# EAGLE design slide_pcb (EAGLE 9.3.0)
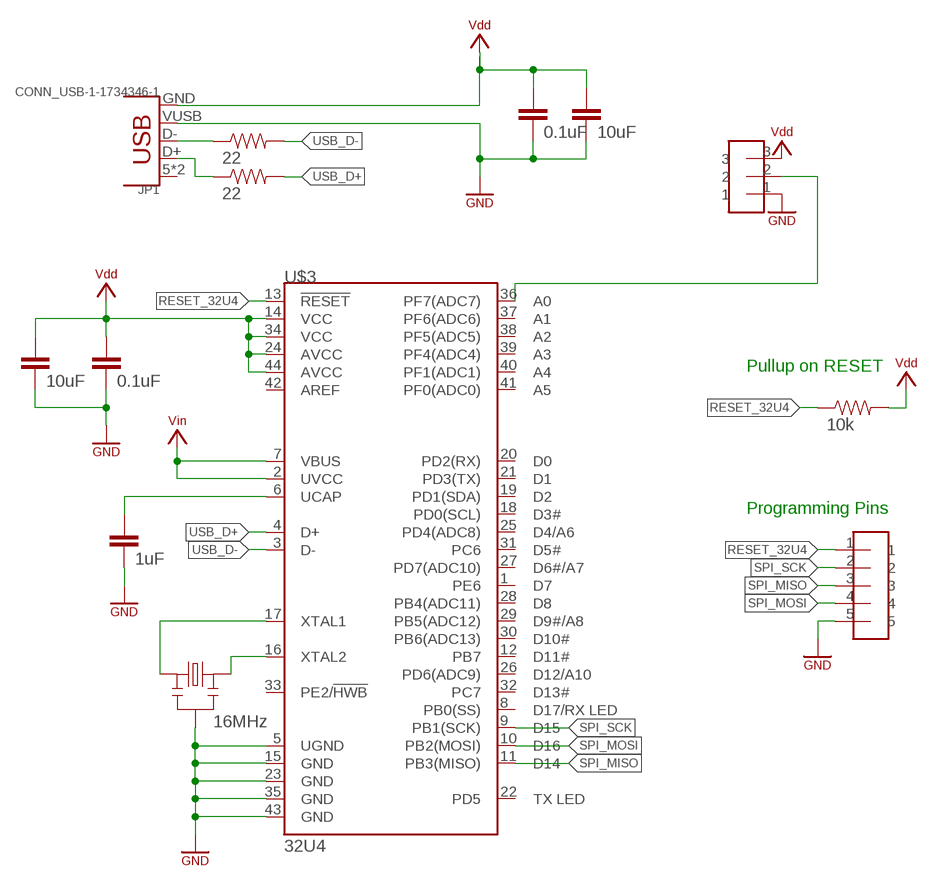
[diagram p0: schematic, sheet 1]

## Parts
C1  0.1uF  COMPONENT_CAP-0805  [0805]
C2  10uF  COMPONENT_CAP-0805  [0805]
C3  1uF  COMPONENT_CAP-0805  [0805]
C6  0.1uF  COMPONENT_CAP-0805  [0805]
C7  10uF  COMPONENT_CAP-0805  [0805]
JP1  CONN_USB-1-1734346-1  [USB-B-SMT]
R1  10k  COMPONENT_RESISTOR-0805  [0805]
R4  22  COMPONENT_RESISTOR-0805  [0805]
R5  22  COMPONENT_RESISTOR-0805  [0805]
U$1  HEADER-3-DIP  [HEADER-3-DIP]
U$2  HEADER-5-TESTPOINT  [TESTPOINT-5]
U$3  32U4  MICRO_ATMEGA32U4TQFP-44  [TQFP44]
Y1  16MHz  COMPONENT_RESONATOR-1.2MM-PITCH  [RESONATOR-SMD]

## Nets
GND: C1.2 C2.2 C3.2 C6.2 C7.2 JP1.VUSB(VBUS) U$1.1 U$2.5 U$3.5(UGND) U$3.15(GND) U$3.23(GND) U$3.35(GND) U$3.43(GND) Y1.2 ; supply symbol labelled SYMBOL_GND
N$1: U$3.17(XTAL1) Y1.1
N$2: U$3.16(XTAL2) Y1.3
N$3: C3.1 U$3.6(UCAP)
N$4: JP1.D- R5.1
N$5: U$1.2 U$3.36(PF7(ADC7))
N$7: JP1.D+ R4.1
RESET_32U4: R1.1 U$2.1 U$3.13(!RESET)
SPI_MISO: U$2.3 U$3.11(PB3(MISO))
SPI_MOSI: U$2.4 U$3.10(PB2(MOSI))
SPI_SCK: U$2.2 U$3.9(PB1(SCK))
USB_D+: R4.2 U$3.4(D+)
USB_D-: R5.2 U$3.3(D-)
VDD: C1.1 C2.1 C6.1 C7.1 JP1.GND R1.2 U$1.3 U$3.14(VCC) U$3.24(AVCC) U$3.34(VCC) U$3.44(AVCC) ; supply symbol labelled SYMBOL_VDD
VIN: U$3.2(UVCC) U$3.7(VBUS) ; supply symbol labelled SYMBOL_VIN
Unconnected: JP1.5(SHIELD) JP1.6(SHIELD) U$3.1(PE6) U$3.8(PB0(SS)) U$3.12(PB7) U$3.18(PD0(SCL)) U$3.19(PD1(SDA)) U$3.20(PD2(RX)) U$3.21(PD3(TX)) U$3.22(PD5) U$3.25(PD4(ADC8)) U$3.26(PD6(ADC9)) U$3.27(PD7(ADC10)) U$3.28(PB4(ADC11)) U$3.29(PB5(ADC12)) U$3.30(PB6(ADC13)) U$3.31(PC6) U$3.32(PC7) U$3.33(PE2/!HWB) U$3.37(PF6(ADC6)) U$3.38(PF5(ADC5)) U$3.39(PF4(ADC4)) U$3.40(PF1(ADC1)) U$3.41(PF0(ADC0)) U$3.42(AREF)

## Notes on the sheet
- Pullup on RESET
- Programming Pins

## Library data of the parts
C1-C3 C6 C7 = homemade-hardware:COMPONENT_CAP: Capacitor Standard 0603 ceramic capacitor, and 0.1" leaded capacitor.
JP1 = homemade-hardware:CONN_USB: 1-1734346-1 <https://www.digikey.com/product-detail/en/te-connectivity-amp-connectors/1-1734346-1/A110862CT-ND/4142246>: USB-B Female Receptacle 10118192-0001LF <https://www.digikey.com/products/en/connectors-interconnects/usb-dvi-hdmi-connectors/312?k=10118192-0001lf&k=&pkeyword=10118192-0001lf&sv=0&pv7=2&sf=0&quantity=&ColumnSort=0&page=1&pageSize=25>: USB-Micro Receptacle 87583-3010RPALF <https://www.digikey.com/product-detail/en/amphenol-icc-fci/87583-3010RPALF/609-4946-6-ND/5355479>: USB-A Female Receptacle 0480372100 <https://www.digikey.com/product-detail/en/molex/0480372100/WM13995DKR-ND/6204368>: USB-A Male Connector
R1 R4 R5 = homemade-hardware:COMPONENT_RESISTOR
U$1 = homemade-hardware:HEADER-3: NPTC081KFXC-RC <https://www.digikey.com/product-detail/en/sullins-connector-solutions/NPTC081KFXC-RC/S5600-ND/776058>: Vertical Female SMD Headers TSM-110-01-T-SV <https://www.digikey.com/product-detail/en/samtec-inc/TSM-110-01-T-SV/SAM12267-ND/6691889>: Vertical Male SMD Headers M20-8890845 <https://www.digikey.com/products/en?keywords=952-3236-ND>: Horizontal Male SMD Headers M20-7910842R <https://www.digikey.com/product-detail/en/harwin-inc/M20-7910842R/952-3200-6-ND/6559341>: Horizontal Female SMD Headers
U$2 = homemade-hardware:HEADER-5: NPTC081KFXC-RC <https://www.digikey.com/product-detail/en/sullins-connector-solutions/NPTC081KFXC-RC/S5600-ND/776058>: Vertical Female SMD Headers TSM-110-01-T-SV <https://www.digikey.com/product-detail/en/samtec-inc/TSM-110-01-T-SV/SAM12267-ND/6691889>: Vertical Male SMD Headers M20-8890845 <https://www.digikey.com/products/en?keywords=952-3236-ND>: Horizontal Male SMD Headers M20-7910842R <https://www.digikey.com/product-detail/en/harwin-inc/M20-7910842R/952-3200-6-ND/6559341>: Horizontal Female SMD Headers
U$3 = homemade-hardware:MICRO_ATMEGA32U4: ATMEGA32U4-AUR: Native USB Microcontroller (used in Arduino Leonardo); PROD_ID: IC-11161
Y1 = homemade-hardware:COMPONENT_RESONATOR: CSTNE8M00GH5C000R0 <https://www.digikey.com/product-detail/en/murata-electronics-north-america/CSTNE8M00GH5C000R0/490-17961-1-ND/8747769>: 8MHz resonator CSTNE12M0G55Z000R0 <https://www.digikey.com/product-detail/en/murata-electronics-north-america/CSTNE12M0G55Z000R0/490-17945-6-ND/8747780>: 12MHz resonator CSTNE16M0VH3C000R0 <https://www.digikey.com/product-detail/en/murata-electronics-north-america/CSTNE16M0VH3C000R0/490-17951-1-ND/8747759>: 16MHz resonator

## Board
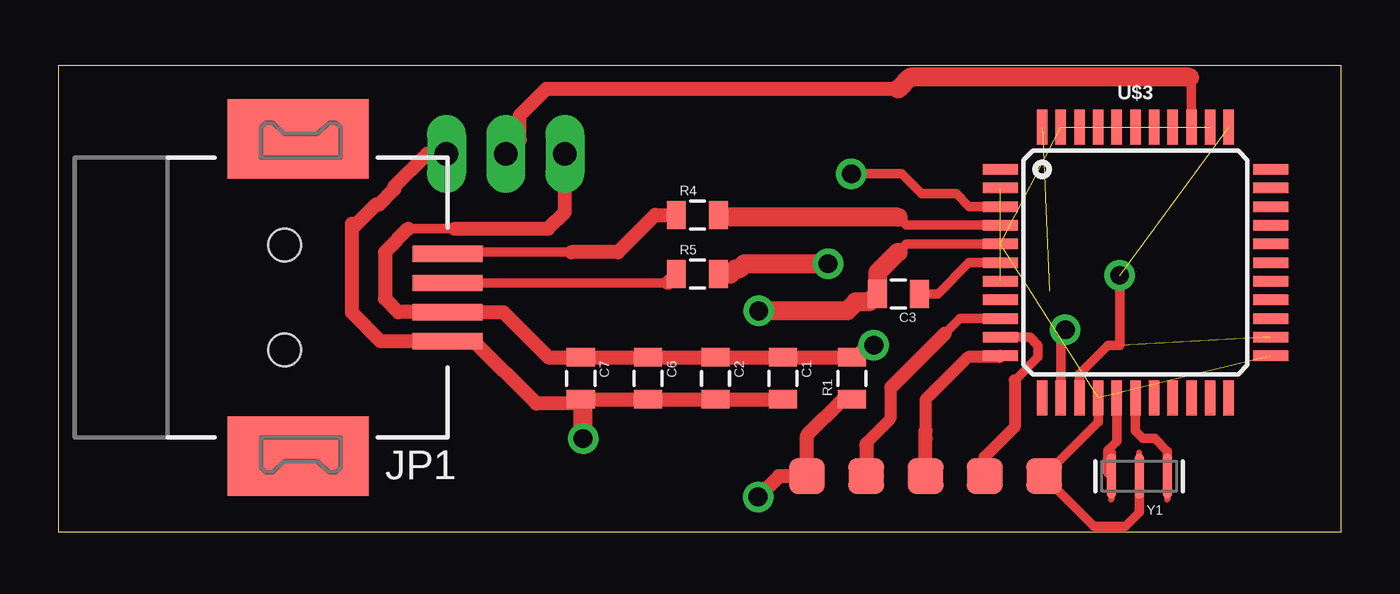
[diagram p1: board, top side]
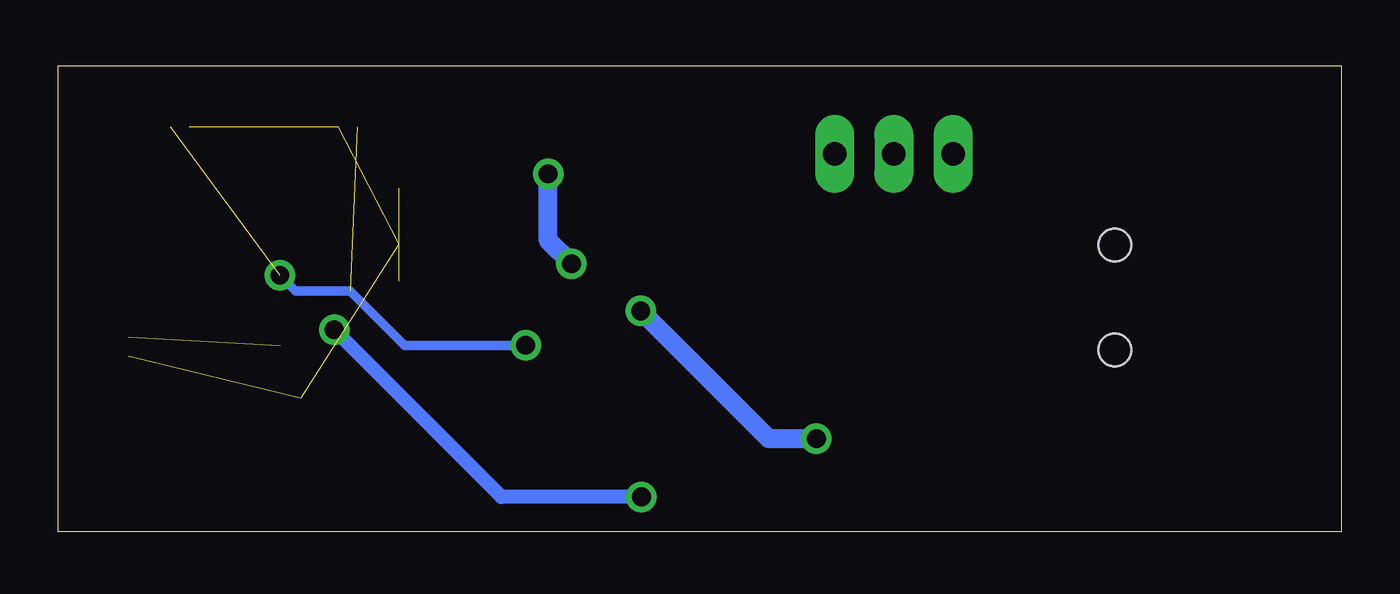
[diagram p2: board, bottom side, seen from below]

Size 55 x 20 mm. Coordinates in mm from the lower left corner, seen from the top.
Outline: 0,0 55,0 55,20 0,20 0,0
Copper layers (1*16): Top 0.035mm / dielectric 1.5mm / Bottom 0.035mm
Design rules "default": minimum track width 16mil, minimum drill 0.8mm, track to track 0.8mm, track to pad 0.8mm, pad to pad 0.8mm, via to via 0.8mm, smd to smd 0mil, copper to edge 1mil, drill to drill 1mil, minimum pad ring 10mil, minimum via ring 10mil, stop-mask expansion 1mil, vias tented up to drill 30mil, thermal gap 10mil

### Footprints (pad centres in the part's own frame; a part is rotated, then mirrored left to right if it is on the bottom)
0805 = smd 0.8 x 1.2: 1 -0.9,0; 2 0.9,0
USB-B-SMT = smd 6.04 x 3.4: 5 0.58,6.8; 6 0.58,-6.8 | smd 3 x 0.7: D+ 7,1.875; D- 7,0.625; GND 7,-0.625; VUSB 7,-1.875 | hole 1.4: 0,2.25; 0,-2.25
HEADER-3-DIP = drill 1.016 pad 1.676 long: 1 0,0; 2 0,2.54; 3 0,5.08
TESTPOINT-5 = smd 1.524 x 1.524: 1 0,0; 2 2.54,0; 3 5.08,0; 4 7.62,0; 5 10.16,0
TQFP44 = smd 1.5 x 0.45: 1 -5.8,4; 2 -5.8,3.2; 3 -5.8,2.4; 4 -5.8,1.6; 5 -5.8,0.8; 6 -5.8,0; 7 -5.8,-0.8; 8 -5.8,-1.6; 9 -5.8,-2.4; 10 -5.8,-3.2; 11 -5.8,-4; 23 5.8,-4; 24 5.8,-3.2; 25 5.8,-2.4; 26 5.8,-1.6; 27 5.8,-0.8; 28 5.8,0; 29 5.8,0.8; 30 5.8,1.6; 31 5.8,2.4; 32 5.8,3.2; 33 5.8,4 | smd 0.45 x 1.5: 12 -4,-5.8; 13 -3.2,-5.8; 14 -2.4,-5.8; 15 -1.6,-5.8; 16 -0.8,-5.8; 17 0,-5.8; 18 0.8,-5.8; 19 1.6,-5.8; 20 2.4,-5.8; 21 3.2,-5.8; 22 4,-5.8; 34 4,5.8; 35 3.2,5.8; 36 2.4,5.8; 37 1.6,5.8; 38 0.8,5.8; 39 0,5.8; 40 -0.8,5.8; 41 -1.6,5.8; 42 -2.4,5.8; 43 -3.2,5.8; 44 -4,5.8
RESONATOR-SMD = smd 0.4 x 1.905: 1 -1.2,0; 2 0,0; 3 1.2,0

### Placement (x,y rotation side)
C1  31.07,6.59 270 top
C2  28.18,6.59 270 top
C3  36.02,10.21 180 top
C6  25.29,6.59 270 top
C7  22.4,6.59 270 top
JP1  9.7,10.05 0 top
R1  34.02,6.59 90 top
R4  27.4,13.59 0 top
R5  27.4,11.05 0 top
U$1  16.64,16.21 270 top
U$2  32.1,2.39 0 top
U$3  46.18,11.55 0 top
Y1  46.34,2.39 180 top

### Tracks (layer width: path | path; a pad name or v marks a point on that pad's centre or on a via)
GND  (via drill 0.8)  (4 unrouted)
  Top 0.406: 46.34,1.34 Y1.2 46.34,0.84 45.74,0.24 44.41,0.24 U$2.5 44.58,4.71 U$3.15 | U$3.5 36.35,12.35 36,12
  Top 0.61: 12.59,13 12.59,9.41 13.82,8.18 JP1.VUSB 17.82,8.18 20.5,5.5 22.21,5.5 C7.2 C6.2 C2.2 C1.2 | 12.59,13 12.59,13.22 | 12.59,13 13.64,14.04 13.76,14.04 14.4,14.69 14.4,14.81 15.8,16.21 U$1.1
  Top 0.813: 36,12 35.12,11.12 C3.2 34.77,9.86 34.2,9.86 33.81,9.48 v30.02,9.48 | v22.5,4 22.5,5.59 C7.2
  Bottom 0.813: v30.02,9.48 24.55,4 v22.5,4
N$1
  Top 0.406: Y1.1 47.54,3.46 47,4 46.5,4 46.18,4.32 U$3.17
N$2
  Top 0.406: 45,3.5 45.38,3.88 U$3.16 | 45,3.5 45,2.53 Y1.3 | Y1.3 45.14,3.36 45,3.5
N$3
  Top 0.406: U$3.6 39.05,11.55 37.71,10.21 C3.1
N$4
  Top 0.406: JP1.D- 26.12,10.68
  Top 0.61: 26.12,10.68 R5.1
N$5
  Top 0.406: U$3.36 48.58,19.42 48.5,19.5
  Top 0.61: U$1.2 19.78,16.81 19.78,17.85 20.91,18.99 36.01,18.99
  Top 0.813: 48.5,19.5 36.52,19.5 36.01,18.99
N$7
  Top 0.406: 22,12 16.77,12
  Top 0.61: JP1.D+ 16.77,12 | R4.1 25.59,13.59 24,12 22,12
RESET_32U4  (via drill 0.8)
  Top 0.406: U$3.13 42.98,8.48 v43.17,8.67
  Top 0.61: R1.1 33.63,5.69 32.1,4.16 U$2.1 30.89,2.39 v30,1.5
  Bottom 0.61: v30,1.5 36,1.5 v43.17,8.67
SPI_MISO
  Top 0.508: U$3.11 40.33,7.5 39,7.5 37.18,5.68 37.18,4
  Top 0.61: U$2.3 37.18,4 37.18,4.35
SPI_MOSI
  Top 0.406: 41.15,8.35 U$3.10 41.65,8.35 42,8 42,7.5 41,6.5
  Top 0.508: 41,6.5 41,4.5 39.72,3.22 U$2.4
SPI_SCK
  Top 0.406: U$3.9 38.65,9.15 38,8.5
  Top 0.508: 35.73,6.22 35.67,6.17 35.67,4.85 34.64,3.82 34.64,3.75
  Top 0.61: 38,8.5 35.73,6.22 | 34.64,3.75 U$2.2 35.11,2.39
USB_D+
  Top 0.406: U$3.4 36.35,13.15 36,13.5
  Top 0.813: 36,13.5 28.39,13.5 R4.2
USB_D-  (via drill 0.8)
  Top 0.406: v34,15.36 36.14,15.36 37,14.5 38.5,14.5 39.05,13.95 U$3.3
  Top 0.813: R5.2 28.8,11.05 29.03,11.28 29.2,11.28 29.42,11.5 v33,11.5
  Bottom 0.813: v33,11.5 34,12.5 v34,15.36
VDD  (via drill 0.8)  (3 unrouted)
  Top 0.406: 14.57,12.57 15,13 17,13 | v45.5,11 45.5,9.5 45.5,9 45.5,8 45,8 43.78,6.78 U$3.14 | v34.97,8 34.53,8 R1.2
  Top 0.61: 15,13 14,12 14,10 14.57,9.43 JP1.GND 19.07,9.43 21.01,7.49 C7.1 C6.1 C2.1 C1.1 R1.2 | 17,13 21,13 21.72,13.72 U$1.3
  Bottom 0.406: v34.97,8 40.16,8 42.48,10.33 44.83,10.33 v45.5,11
VIN  (1 unrouted)